# Altium project Boards for simple simulation.PrjPcb
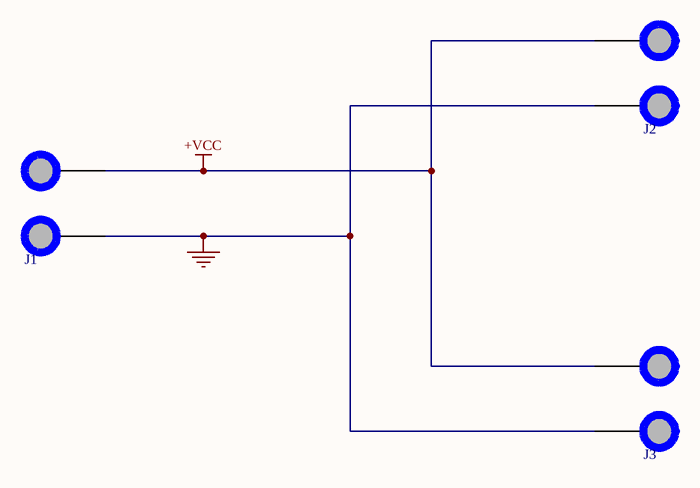
[diagram p0: Schematic.SchDoc]
1 sheet, 3 parts. Net scope: global (net labels, ports and power ports of the same name join across sheets).
Board files: PCB01.PcbDoc, PCB02.PcbDoc, PCB03.PcbDoc, PCB04.PcbDoc, PCB05.PcbDoc, PCB06.PcbDoc, PCB07.PcbDoc, PCB08.PcbDoc, PCB08-wide.PcbDoc

## Sheet Schematic.SchDoc
size A

### Parts
J1  Doublepad  [DOUBLEPAD_WITH_HOLE_4MMx1MM5]  (value not drawn)
J2  Doublepad  [DOUBLEPAD_WITH_HOLE_4MMx1MM5]  (value not drawn)
J3  Doublepad  [DOUBLEPAD_WITH_HOLE_4MMx1MM5]  (value not drawn)

### Nets
+VCC: J1.1 J2.1 J3.1
GND: J1.2 J2.2 J3.2

### Library data of the parts
J1-J3 = DOUBLEPAD_WITH_HOLE_4MMx1MM5